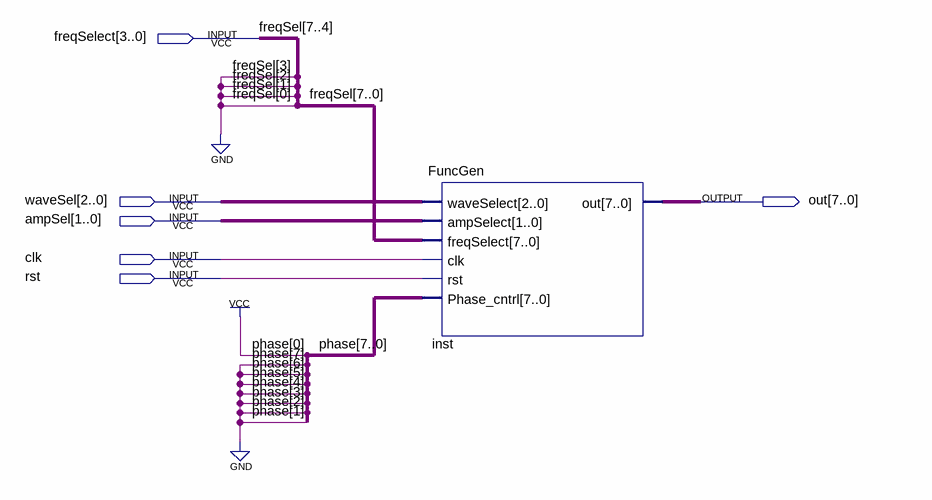
[diagram p0: schematic sheet]
// Quartus schematic final.bdf as structural Verilog: 1 symbols, 6 pins
module \final  (
  input  [3:0] freqSelect,
  input  [2:0] waveSel,
  input  [1:0] ampSel,
  input  clk,
  input  rst,
  output [7:0] out
);

  FuncGen inst (
    .waveSelect(waveSel), .ampSelect(ampSel), .freqSelect({freqSelect, 4'b0000}), .clk(clk), .rst(rst),
    .Phase_cntrl(8'b00000001), .out(out));

  // Other names for the same wires on the sheet: freqSel[7:4] = freqSelect
endmodule
